# EasyEDA Pro project ProPrj_ExtModule-003_2025-06-06.epro

# Schematic ExtModule-003
Board Name: ExtModule-003; Create Date: 2025-05-14; Page Name: Core; Project Name: ExtModule-003; Schematic Name: ExtModule-003; Update Date: 2025-05-14; Company: 嘉立创EDA; Page Size: A4; Version: V1.0
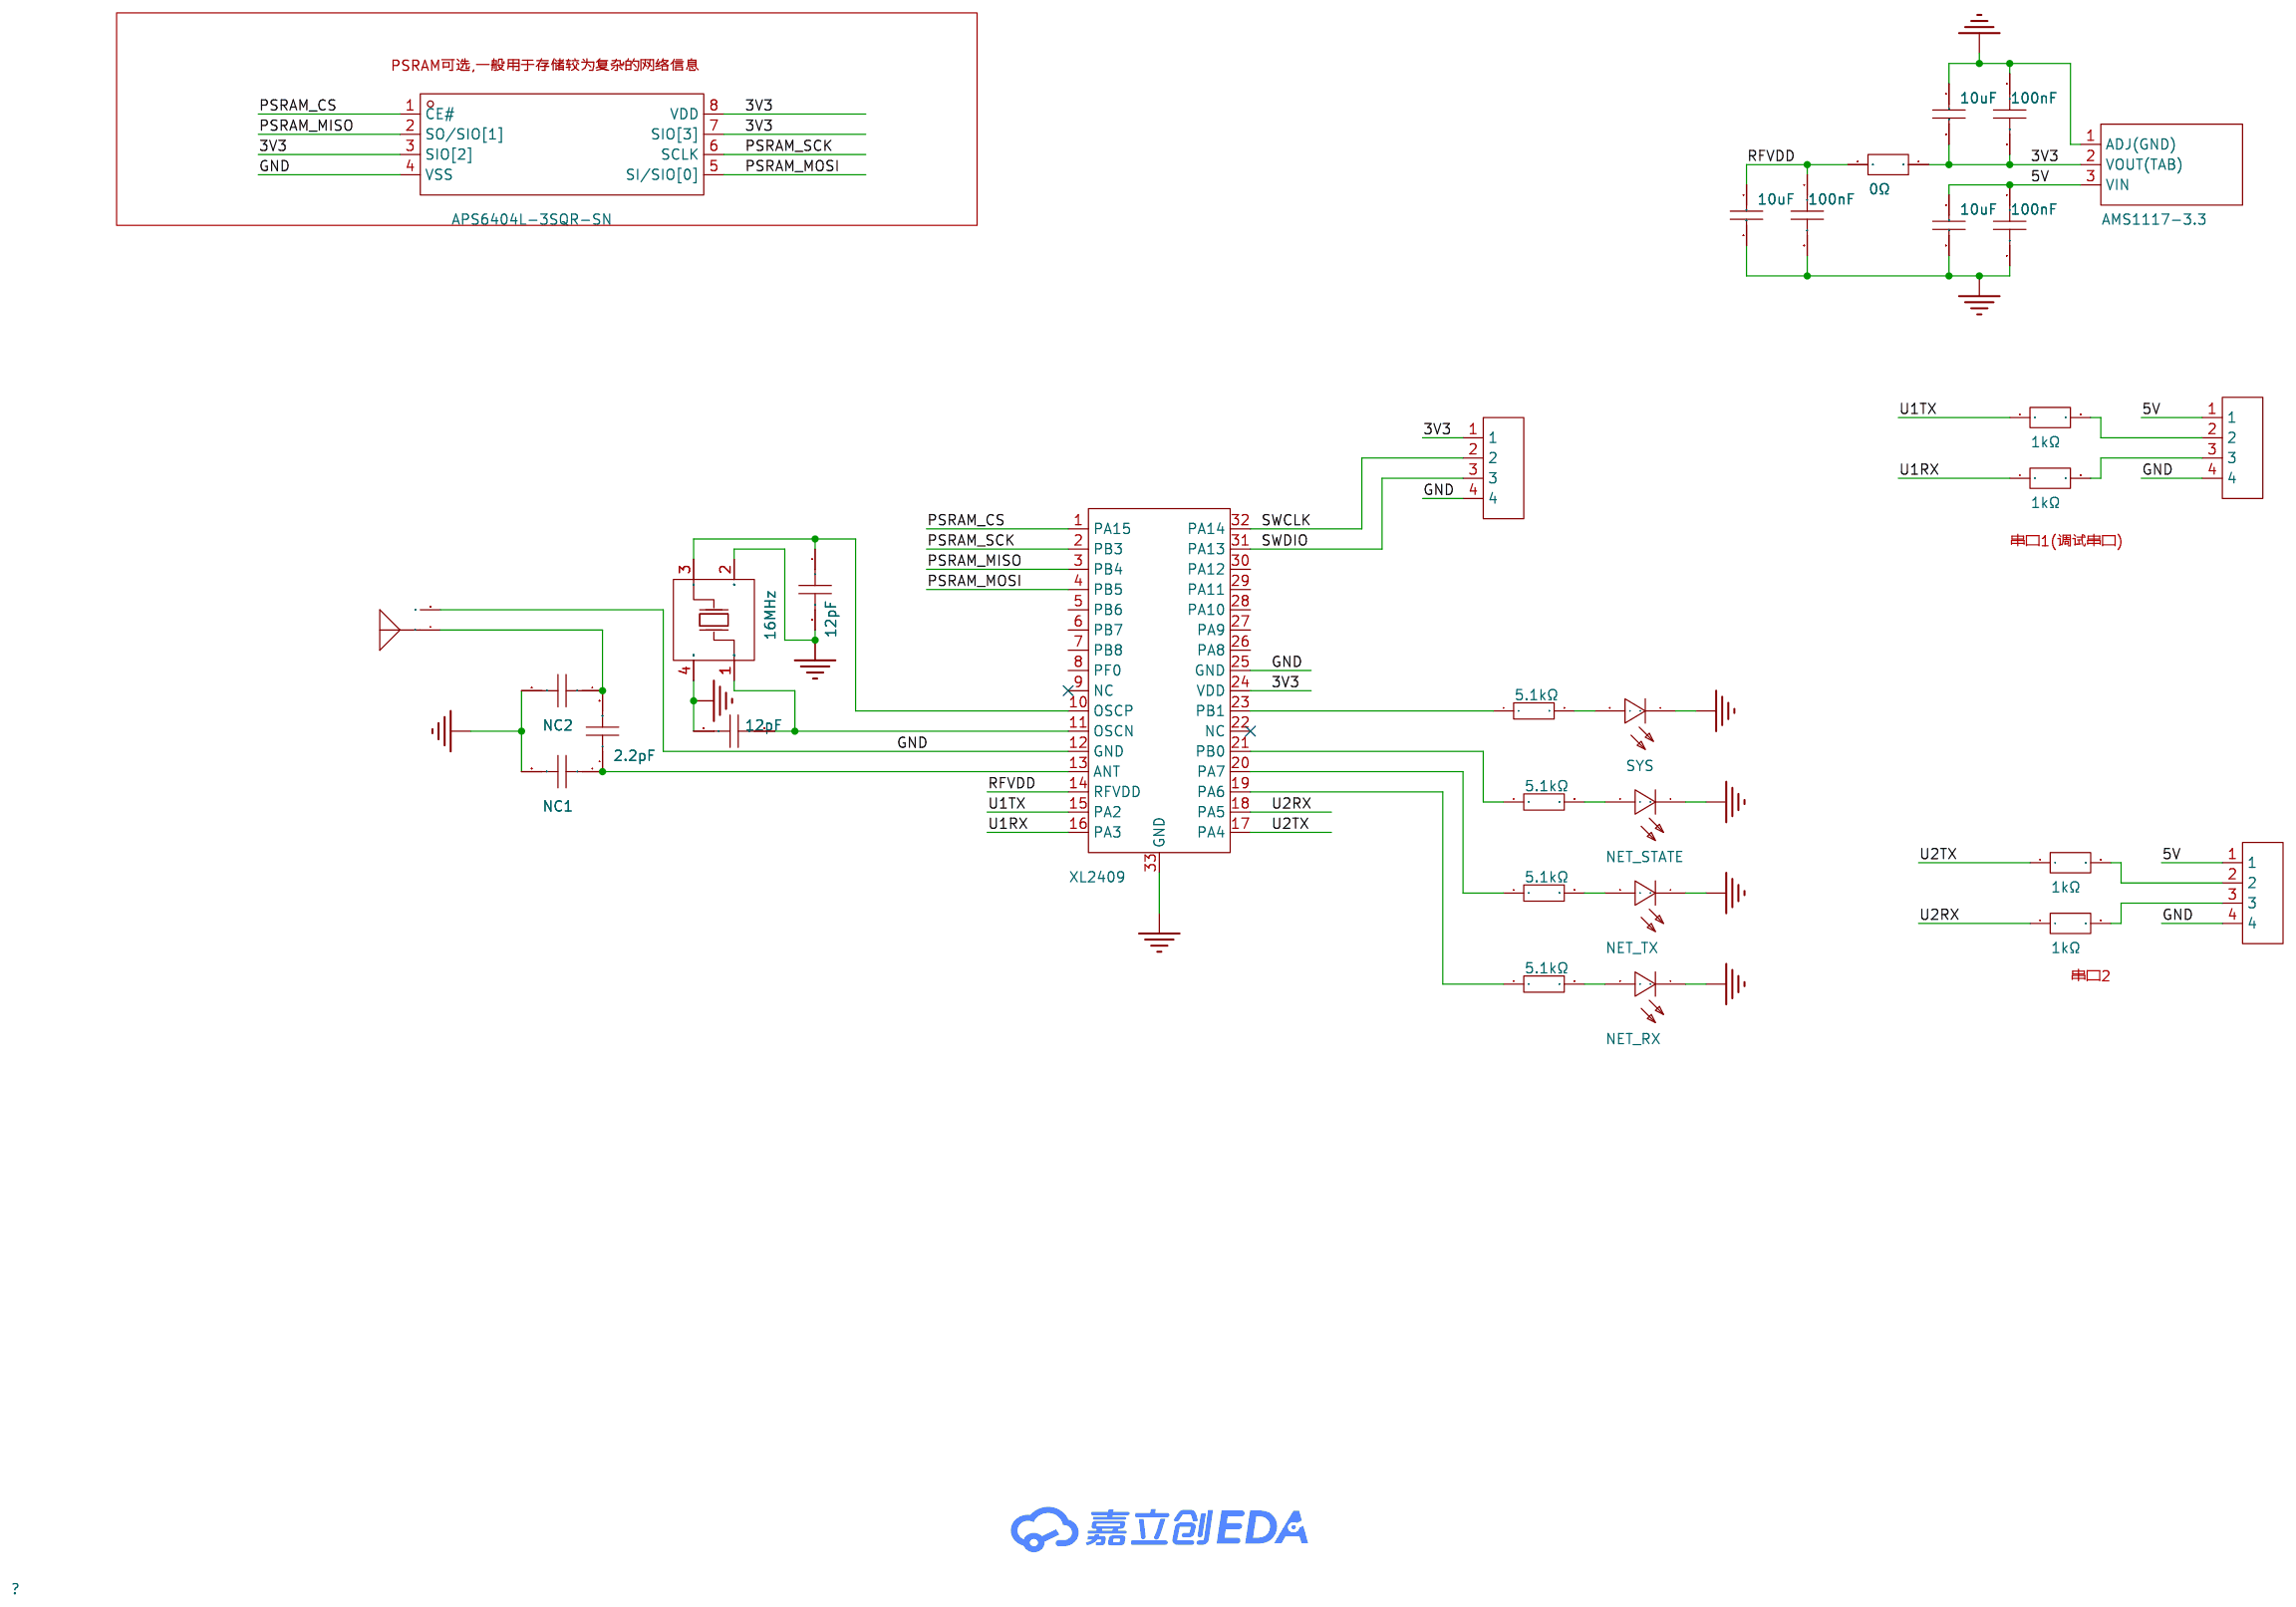
[diagram p0: schematic sheet]

## Parts
C3  100nF  [C0402]
C4  10uF  [C0402]
C5  10uF  [C0402]
C6  100nF  [C0402]
C7  10uF  [C0402]
C8  100nF  [C0402]
C9  2.2pF  [C0402]
C10  12pF  [C0402]
C11  12pF  [C0402]
H1  PZ254R-11-04P  [HDR-TH_4P-P2.54-H-M-W10.4]
H2  PZ254R-11-04P  [HDR-TH_4P-P2.54-H-M-W10.4]
H3  PZ254R-11-04P  [HDR-TH_4P-P2.54-H-M-W10.4]
L1  KH-3216-A27  [ANT-SMD_L3.2-W1.6]
LED2  SYS  [LED0603-RD_RED]
LED3  NET_STATE  [LED0603-RD_RED]
LED4  NET_TX  [LED0603-RD_RED]
LED5  NET_RX  [LED0603-RD_RED]
NC1  9pF  [C0402]  (no BOM)
NC2  9pF  [C0402]  (no BOM)
R1  0Ω  [R0402]
R18  5.1kΩ  [R0402]
R19  5.1kΩ  [R0402]
R20  5.1kΩ  [R0402]
R21  5.1kΩ  [R0402]
R22  1kΩ  [R0402]
R23  1kΩ  [R0402]
R24  1kΩ  [R0402]
R25  1kΩ  [R0402]
U1  XL2409  [QFN-32_L4.0-W4.0-P0.40-BL-EP2.7-A]
U2  AMS1117-3.3  [SOT-89_L4.5-W2.5-P1.50-LS4.2-BR]
U3  APS6404L-3SQR-SN  [SOIC-8_L4.9-W3.9-P1.27-LS6.0-BL]
X1  16MHz  [CRYSTAL-SMD_4P-L3.2-W2.5-BL]

## Library data of the parts
C3 C6 C8 = CC0402KRX7R7BB104: 容值:100nF;精度:±10%;额定电压:16V;材质(温度系数):X7R;; LCSC Part Name: 100nF ±10% 16V; Supplier Part: C60474; Manufacturer: YAGEO(国巨); Supplier Footprint: 0402; JLCPCB Part Class: Extended Part; Datasheet: https://atta.szlcsc.com/upload/public/pdf/source/20211223/9278FD768280B81DDBEF48FA36411A03.pdf; Supplier: LCSC; Tolerance: ±10%; Voltage Rated: 16V; Temperature Coefficient: X7R
C4 C5 C7 = CL05A106MQ5NUNC: 容值:10uF;精度:±20%;额定电压:6.3V;材质(温度系数):X5R;; LCSC Part Name: 10uF ±20% 6.3V; Supplier Part: C15525; Manufacturer: SAMSUNG(三星); Supplier Footprint: 0402; JLCPCB Part Class: 基础库; Datasheet: https://atta.szlcsc.com/upload/public/pdf/source/20220823/2B02EE04F8F211D38A52DCB16EB6BEBA.pdf; Supplier: LCSC; Tolerance: ±20%; Voltage Rated: 6.3V; Temperature Coefficient: X5R
C9 = CC0402BRNPO9BN2R2: 容值:2.2pF;额定电压:50V;材质(温度系数):NP0;; LCSC Part Name: 2.2pF 50V; Supplier Part: C325452; Manufacturer: YAGEO(国巨); Supplier Footprint: 0402; JLCPCB Part Class: 扩展库; Datasheet: https://atta.szlcsc.com/upload/public/pdf/source/20181031/C325452_4BAE4C53276CB88B8759B0E825662D7E.pdf; Supplier: LCSC; Voltage Rated: 50V; Temperature Coefficient: NP0
C10 C11 = CC0402FRNPO9BN120: 容值:12pF;精度:±1%;额定电压:50V;材质(温度系数):NP0;; LCSC Part Name: 12pF ±1% 50V; Supplier Part: C326662; Manufacturer: YAGEO(国巨); Supplier Footprint: 0402; JLCPCB Part Class: 扩展库; Datasheet: https://atta.szlcsc.com/upload/public/pdf/source/20181031/C326662_7F085433F615688AED0238E361F212AA.pdf; Supplier: LCSC; Tolerance: ±1%; Voltage Rated: 50V; Temperature Coefficient: NP0
H1-H3 = PZ254R-11-04P: 插针结构:1x4P;间距:2.54mm;行距:-;圆针/方针:方针;安装方式:弯插;排数:单排;总PIN位数:4P;额定电流:-;额定电压:-;配合针长度:6mm;塑高:2.5mm;触头材质:黄铜;触头镀层:-;工作温度:-40℃~+105℃;颜色:黑色;; LCSC Part Name: 1x4P 间距:2.54mm 方针 弯插; Supplier Part: C492412; Manufacturer: XFCN(兴飞); Supplier Footprint: 弯插,P=2.54mm; JLCPCB Part Class: 扩展库; Datasheet: https://atta.szlcsc.com/upload/public/pdf/source/20200309/C492412_B0EFFC1946AB079B8871416C4A09EF6C.pdf; Supplier: LCSC; Pin Structure: 1x4P; Pitch: 2.54mm; Circluar Pins/Square Pins: 方针; Mounting Type: 弯插; Number of Rows: 单排; Number of Pins: 4P; Length of Mating Pin: 6mm; Insulation Height: 2.5mm; Contact Material: 黄铜; Operating Temperature: -40℃~+105℃; Color: 黑色
L1 = KH-3216-A27: LCSC Part Name: Chip蓝牙贴片3.2x1.6; Supplier Part: C504001; Manufacturer: kinghelm(金航标); Supplier Footprint: 1206; JLCPCB Part Class: 扩展库; Datasheet: https://atta.szlcsc.com/upload/public/pdf/source/20200330/C504001_1885788A99ECD25C59FD63C2239A9775.pdf; Supplier: LCSC
LED2-LED5 = NCD0603R1_C84263: 灯头类型:-;发光颜色:红色;正向电压(VF):1.6V~2.6V;功率:65mW;正向电流:20mA;主波长:615nm~630nm;二极管配置:独立二极管;透镜颜色:无色透明透镜;色温:-;发光强度:80mcd~220mcd;发光角度:130°;载带方式:-;工作温度:-30℃~+85℃;; LCSC Part Name: NCD0603R1; Supplier Part: C84263; Manufacturer: 国星光电; Manufacturer Part: NCD0603R1; Supplier Footprint: 0603; JLCPCB Part Class: 扩展库; Datasheet: https://atta.szlcsc.com/upload/public/pdf/source/20200820/C84263_DABC6A75E58F576973B407FDBA283D60.pdf; Supplier: LCSC; Emitted Color: 红色; Forward Voltage (VF): 1.6V~2.6V; Power Dissipation: 65mW; Forward Current: 20mA; Dominant Wavelength: 615nm~630nm; Diode Configuration: 独立二极管; Lens Color: 无色透明透镜; Luminous Intensity: 80mcd~220mcd; Viewing Angle: 130°; Operating Temperature: -30℃~+85℃
NC1 NC2 = CC0402CRNPO9BN9R0: 容值:9pF;额定电压:50V;材质(温度系数):NP0;; LCSC Part Name: 9pF 50V; Supplier Part: C282242; Manufacturer: YAGEO(国巨); Supplier Footprint: 0402; JLCPCB Part Class: 扩展库; Datasheet: https://atta.szlcsc.com/upload/public/pdf/source/20181008/C309499_21CC21451B82C39E3D92150FD6B30293.pdf; Supplier: LCSC; Voltage Rated: 50V; Temperature Coefficient: NP0
R1 = FRC0402P000 TS: 电阻类型:厚膜电阻;阻值:0Ω;精度:±5%;功率:62.5mW;最大工作电压:50V;; LCSC Part Name: 0Ω ±5% 62.5mW 厚膜电阻; Supplier Part: C2906877; Manufacturer: FOJAN(富捷); Supplier Footprint: 0402; JLCPCB Part Class: 扩展库; Datasheet: https://atta.szlcsc.com/upload/public/pdf/source/20211221/925EC7D7225764EE0046F22065062C87.pdf; Supplier: LCSC; Type: 厚膜电阻; Tolerance: ±5%; Power(Watts): 62.5mW; Overload Voltage (Max): 50V; Operating Temperature Range: -55℃~+155℃
R18-R21 = 0402WGF5101TCE: 阻值:5.1kΩ;精度:±1%;功率:62.5mW;温度系数:±100ppm/℃;电阻类型:厚膜电阻;; LCSC Part Name: 5.1kΩ ±1% 62.5mW 厚膜电阻; Supplier Part: C25905; Manufacturer: UNI-ROYAL(厚声); Supplier Footprint: 0402; JLCPCB Part Class: Basic Part; Datasheet: https://atta.szlcsc.com/upload/public/pdf/source/20200306/C422600_1E6D84923E4A46A82E41ADD87F860B5C.pdf; Supplier: LCSC; Tolerance: ±1%; Power(Watts): 62.5mW; Overload Voltage (Max): 50V; Temperature Coefficient: ±100ppm/℃; Type: 厚膜电阻; Operating Temperature Range: -55℃~+155℃
R22-R25 = RT0402BRD071KL: 电阻类型:薄膜电阻;阻值:1kΩ;精度:±0.1%;功率:62.5mW;最大工作电压:50V;温度系数:±25ppm/℃;; LCSC Part Name: 薄膜电阻 1kΩ ±0.1% 62.5mW; Supplier Part: C852624; Manufacturer: YAGEO(国巨); Supplier Footprint: 0402; JLCPCB Part Class: 扩展库; Datasheet: https://atta.szlcsc.com/upload/public/pdf/source/20210609/C852624_9EB141A274604F87C6BB037C8019D50A.pdf; Supplier: LCSC; Type: 薄膜电阻; Tolerance: ±0.1%; Power(Watts): 62.5mW; Overload Voltage (Max): 50V; Temperature Coefficient: ±25ppm/℃; Operating Temperature Range: -55℃~+155℃
U1 = xl2409: Supplier Part: C9900060824; Supplier Footprint: QFN32 4x4; Supplier: LCSC
U2 = AMS1117-3.3_C347256: 输出类型:固定;工作电压:18V;输出电压:3.3V;输出电流:1A;电源纹波抑制比(PSRR):60dB@(120Hz);输出极性:正极;; LCSC Part Name: 输出:3.3V 电流:1A 耐压:18V; Supplier Part: C347256; Manufacturer: UMW(友台半导体); Supplier Footprint: SOT-89; JLCPCB Part Class: 扩展库; Datasheet: https://atta.szlcsc.com/upload/public/pdf/source/20241218/BAF0263FA2E44BCD8AF41AA4FA04EFAA.pdf; Supplier: LCSC; Output Type: 固定; Voltage - Supply: 18V; Output Voltage: 3.3V; Output Current: 1A; Power Supply Rejection Ratio (PSRR): 60dB@(120Hz); Voltage Dropout: 1.3V@(1A); Features: 过流保护; Output Configuration: 正极; Number of Outputs: 1
U3 = APS6404L-3SQR-SN_C5333729: Supplier Part: C5333729; Manufacturer: Apmemory; Supplier Footprint: SOP-8; JLCPCB Part Class: 扩展库; Datasheet: https://atta.szlcsc.com/upload/public/pdf/source/20230206/47F6F63A2B63C528FEFCE249E0943D90.pdf; Supplier: LCSC
X1 = X322516MOB4SI: 晶振类型:贴片晶振;频率:16MHz;常温频差:±10ppm;负载电容:12pF;频率稳定度:±20ppm;; LCSC Part Name: 16MHz ±10ppm 12pF; Supplier Part: C12668; Manufacturer: YXC(扬兴晶振); Supplier Footprint: SMD3225-4P; JLCPCB Part Class: 扩展库; Datasheet: https://atta.szlcsc.com/upload/public/pdf/source/20240329/19D5F850207469550BEB00D7DFEDBC7A.pdf; Supplier: LCSC; Type: 贴片晶振; Normal temperature Frequency Tolerance: ±10ppm; Load Capacitance: 12pF; Frequency Stability: ±20ppm; Operating Temperature: -40℃~+85℃

## Nets
3V3: C3.2 C4.2 H1.1 R1.1 U1.24(VDD) U2.2(VOUT(TAB)) U3.3(SIO[2]) U3.7(SIO[3]) U3.8(VDD)
5V: C5.1 C6.1 H2.1 H3.1 U2.3(VIN)
GND: C3.1 C4.1 C5.2 C6.2 C7.2 C8.2 C10.2 C11.2 H1.4 H2.4 H3.4 L1.2 LED2.1(K) LED3.1(K) LED4.1(K) LED5.1(K) NC1.2 NC2.2 U1.12(GND) U1.25(GND) U1.33(GND) U2.1(ADJ(GND)) U3.4(VSS) X1.2(GND) X1.4(GND)
PSRAM_CS: U1.1(PA15) U3.1(CE#)
PSRAM_MISO: U1.3(PB4) U3.2(SO/SIO[1])
PSRAM_MOSI: U1.4(PB5) U3.5(SI/SIO[0])
PSRAM_SCK: U1.2(PB3) U3.6(SCLK)
RFVDD: C7.1 C8.1 R1.2 U1.14(RFVDD)
SWCLK: H1.2 U1.32(PA14)
SWDIO: H1.3 U1.31(PA13)
U1RX: R23.1 U1.16(PA3)
U1TX: R22.1 U1.15(PA2)
U2RX: R25.1 U1.18(PA5)
U2TX: R24.1 U1.17(PA4)
$1N1097: C9.2 L1.1(ANT) NC2.1
$1N1099: C9.1 NC1.1 U1.13(ANT)
$1N1315: C10.1 U1.11(OSCN) X1.1(OSC1)
$1N1320: C11.1 U1.10(OSCP) X1.3(OSC2)
$1N1862: LED2.2(A) R18.2
$1N1909: R18.1 U1.23(PB1)
$1N2006: LED3.2(A) R19.2
$1N2104: LED4.2(A) R20.2
$1N2202: LED5.2(A) R21.2
$1N2207: R19.1 U1.21(PB0)
$1N2213: R20.1 U1.20(PA7)
$1N2219: R21.1 U1.19(PA6)
$1N2527: H2.3 R23.2
$1N2533: H2.2 R22.2
$1N2540: H3.2 R24.2
$1N2547: H3.3 R25.2

Not connected (* = marked no-connect by the designer): U1 5(PB6) 6(PB7) 7(PB8) 8(PF0) 9(NC)* 22(NC)* 26(PA8) 27(PA9) 28(PA10) 29(PA11) 30(PA12)

## Notes on the sheet
- PSRAM可选,一般用于存储较为复杂的网络信息
- 串口1(调试串口)
- 串口2

# Board ExtModule-003
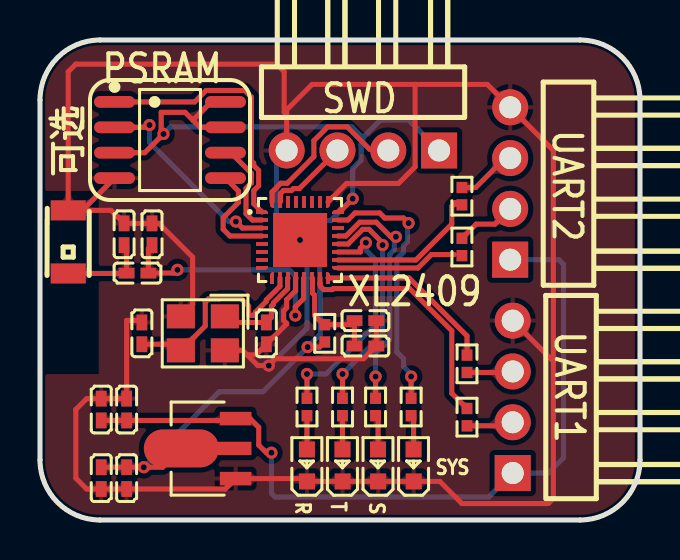
[diagram p1: board, top side]
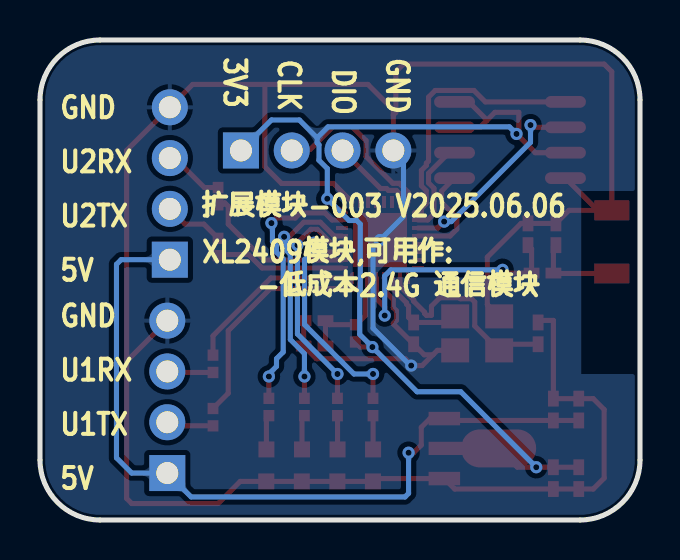
[diagram p2: board, bottom side, seen from below]

Outline 30 x 24 mm; copper layers: Top Layer, Bottom Layer. Coordinates in mm from the lower left corner of the outline.
Outline path: 0,21 0,3 arc(0.88,0.88) 3,0 27,0 arc(29.12,0.88) 30,3 30,21 arc(29.12,23.12) 27,24 3,24 arc(0.88,23.12) 0,21
Stack: Top Layer 0.035mm / Dielectric1 1.51mm FR4 er 4.5 / Bottom Layer 0.035mm

## Design rules (mm)
template: JLCPCB Capability(Two Layers Board)
spacing copperThickness1oz (default): track to track 0.102, other pairs 0.152 to 0.3
spacing copperThickness2oz: track to track 0.203, other pairs 0.152 to 0.3
track width copperThickness1oz (default): min 0.127, default 0.254, max 2.54
track width copperThickness2oz: min 0.203, default 0.254, max 2.54
differential pair differentialPair (default): width min 0.127, default 0.254, max 2.54; gap min 0.152, default 0.152
via viaSize (default): diameter min 0.5, default 0.61, max 10; hole min 0.3, default 0.305, max 6.3

## Placement (name value [footprint] x y rotation side)
C3  100nF  [C0402]  3.06 2.09 90 top
C4  10uF  [C0402]  4.33 2.09 90 top
C5  10uF  [C0402]  4.33 5.52 90 top
C6  100nF  [C0402]  3.06 5.52 90 top
C7  10uF  [C0402]  16.27 9.97 0 top
C8  100nF  [C0402]  16.27 8.7 0 top
C9  2.2pF  [C0402]  4.88 12.35 180 top
C10  12pF  [C0402]  11.32 9.33 270 top
C11  12pF  [C0402]  5.09 9.33 90 top
H1  PZ254R-11-04P  [HDR-TH_4P-P2.54-H-M-W10.4]  16.14 18.48 180 top
H2  PZ254R-11-04P  [HDR-TH_4P-P2.54-H-M-W10.4]  23.64 6.16 90 top
H3  PZ254R-11-04P  [HDR-TH_4P-P2.54-H-M-W10.4]  23.51 16.83 90 top
L1  KH-3216-A27  [ANT-SMD_L3.2-W1.6]  1.41 13.91 90 top
LED2  SYS  [LED0603-RD_RED]  18.68 2.73 90 top
LED3  NET_STATE  [LED0603-RD_RED]  16.91 2.73 90 top
LED4  NET_TX  [LED0603-RD_RED]  15.13 2.73 90 top
LED5  NET_RX  [LED0603-RD_RED]  13.35 2.73 90 top
NC1  9pF  [C0402]  5.6 14.29 90 top
NC2  9pF  [C0402]  4.21 14.29 90 top
R1  0Ω  [R0402]  14.24 9.33 90 top
R18  5.1kΩ  [R0402]  18.56 5.65 270 top
R19  5.1kΩ  [R0402]  16.78 5.65 270 top
R20  5.1kΩ  [R0402]  15.13 5.65 270 top
R21  5.1kΩ  [R0402]  13.35 5.65 270 top
R22  1kΩ  [R0402]  21.35 5.14 270 top
R23  1kΩ  [R0402]  21.35 7.81 270 top
R24  1kΩ  [R0402]  21.1 13.65 90 top
R25  1kΩ  [R0402]  21.1 16.19 90 top
U1  XL2409  [QFN-32_L4.0-W4.0-P0.40-BL-EP2.7-A]  13 14 270 top
U2  AMS1117-3.3  [SOT-89_L4.5-W2.5-P1.50-LS4.2-BR]  8.43 3.57 0 top
U3  APS6404L-3SQR-SN  [SOIC-8_L4.9-W3.9-P1.27-LS6.0-BL]  6.5 19 270 top
X1  16MHz  [CRYSTAL-SMD_4P-L3.2-W2.5-BL]  8.14 9.33 180 top

## Footprints (pads in the part's own frame, mm; a bottom-side part is the same pattern mirrored in y, then rotated)
ANT-SMD_L3.2-W1.6
  rect 1x1.75 smd: 1(-1.578,0) 2(1.578,0)
C0402
  rect 0.79x0.54 smd: 1(-0.545,0) 2(0.545,0)
CRYSTAL-SMD_4P-L3.2-W2.5-BL
  rect 1.4x1.2 smd: 1(-1.1,-0.85) 2(1.1,-0.85) 3(1.1,0.85) 4(-1.1,0.85)
HDR-TH_4P-P2.54-H-M-W10.4
  rect 1.8x1.8 hole 1.1: 1(-3.81,0)
  round 1.8 hole 1.1: 2(-1.27,0) 3(1.27,0) 4(3.81,0)
LED0603-RD_RED
  rect 0.8x0.8 smd: 1(-0.799,-0.004) 2(0.799,0.004)
QFN-32_L4.0-W4.0-P0.40-BL-EP2.7-A
  custom 0.2x0.601 smd: 1(-1.401,-1.9) 8(1.401,-1.9) 17(1.4,1.9) 24(-1.401,1.9)
  rect 0.2x0.6 smd: 2(-1,-1.9) 3(-0.6,-1.9) 4(-0.2,-1.9) 5(0.2,-1.9) 6(0.6,-1.9) 7(1,-1.9) 18(1,1.9) 19(0.6,1.9) 20(0.2,1.9) 21(-0.2,1.9) 22(-0.6,1.9) 23(-1,1.9)
  custom 0.601x0.2 smd: 9(1.9,-1.401) 16(1.9,1.4) 25(-1.9,1.401) 32(-1.9,-1.401)
  rect 0.6x0.2 smd: 10(1.9,-1) 11(1.9,-0.6) 12(1.9,-0.2) 13(1.9,0.2) 14(1.9,0.6) 15(1.9,1) 26(-1.9,1) 27(-1.9,0.6) 28(-1.9,0.2) 29(-1.9,-0.2) 30(-1.9,-0.6) 31(-1.9,-1)
  rect 2.7x2.7 smd: 33(0,0)
R0402
  rect 0.566x0.54 smd: 1(-0.433,0) 2(0.433,0)
SOIC-8_L4.9-W3.9-P1.27-LS6.0-BL
  oval 0.588x2.045 smd: 1(-1.905,-2.772) 2(-0.635,-2.772) 3(0.635,-2.772) 4(1.905,-2.772) 5(1.905,2.772) 6(0.635,2.772) 7(-0.635,2.772) 8(-1.905,2.772)
SOT-89_L4.5-W2.5-P1.50-LS4.2-BR
  rect 1.575x0.672 smd: 1(1.356,-1.5) 3(1.356,1.5)
  custom 5.377x1.9 smd: 2(-1.356,0.009)

## Nets
As in the schematic.

Pads without a net: U1 5 6 7 8 9 22 26 27 28 29 30

## Via types
v1: diameter 0.61, hole 0.305, Top Layer to Bottom Layer, 19 vias

## Routing (per net, layer and track width the routed paths; a pad name or vN(x,y) marks a point on that pad's centre or on a via; arc(x,y) is an arc through that point)
3V3: length 53.5
  Top Layer w0.254: v1(13.38,8.65) 13.99,8.65 R1.1 ; U3.7 8,19.64 7.65,19.99 ; U3.8 8.56,20.91 7.65,19.99 ; U3.3 5.24,18.36 v1(6.17,19.3) 6.06,19.42 6.06,20.38 7.26,20.38 7.65,19.99 ; 7.07,3.58 6.13,2.64 v1(5.19,2.64) C4.2 C3.2 ; v1(15.63,16.06) 15.13,15.56 15.06,15.56 U1.24
  Bottom Layer w0.254: v1(5.19,2.64) 8.96,6.41 11.15,6.41 v1(13.38,8.65) 14.01,9.28 14.01,11.37 13.98,11.4 13.98,14.79 14.16,14.97 14.54,14.97 v1(15.63,16.06) 15.63,17.57 16.05,17.99 16.05,18.77 16.14,18.86 16.14,19.11 ; v1(6.17,19.3) 6.53,19.66 15.6,19.66 16.14,19.11 ; 16.14,19.11 17.03,20 18.43,20 H1.1
5V: length 39.7
  Top Layer w0.254: C6.1 C5.1 9.69,4.98 U2.3 10.5,5.07 10.94,4.63 10.94,3.75 11.32,3.36 v1(11.57,3.36)
  Bottom Layer w0.254: H3.1 25.94,13.02 26.18,12.78 26.18,3.11 25.41,2.35 H2.1 22.44,1.15 11.75,1.15 11.57,1.33 v1(11.57,3.36)
GND: length 142.1
  Top Layer w0.254: 25.67,7.94 25.67,1.08 25.41,0.82 21.1,0.82 19.99,1.93 LED2.1 LED3.1 LED4.1 LED5.1 13.21,2.07 U2.1 9.26,1.55 C4.1 C3.1 2.34,1.55 1.79,2.09 1.79,5.52 2.34,6.07 C6.2 C5.2 4.33,9.98 4.99,9.98 C11.2 ; 25.67,7.94 25.67,18.48 H3.4 22.37,21.78 18.76,21.78 ; 25.67,7.94 H2.4 ; X1.2 7.63,10.78 7.63,13.14 5.95,14.83 NC1.2 NC2.2 3.55,15.48 2.12,15.48 U3.4 ; 10.35,8.26 10.89,7.72 v1(11.44,7.72) 11.44,7.77 11.74,8.06 16.18,8.06 C8.2 C7.2 ; 10.35,8.26 10.79,8.26 C10.2 12.33,9.8 12.33,9.83 12.18,9.98 12.18,10.46 12.33,10.62 12.33,11.02 12.78,11.46 12.78,12.08 U1.12 ; 10.35,8.26 10.13,8.48 X1.4 ; U1.25 15.33,16.83 17.92,16.83 18.76,17.66 18.76,21.78 ; 18.76,21.78 13.6,21.78 12.33,20.51 12.33,20.25 ; 12.33,20.25 H1.4 ; 12.33,20.25 12.21,20.38 12.21,22.41 11.82,22.8 1.79,22.8 1.41,22.41 L1.2
  Bottom Layer w0.254: v1(11.44,7.72) 11.48,7.72 13.35,9.59 13.35,13.65 v1(13,14) 11.82,15.17 11.82,17.97 H1.4
PSRAM_CS: length 13.4
  Top Layer w0.254: U3.1 7.73,20.91 8.31,21.48 10.24,21.48 10.57,21.14 10.57,17.95 10.68,17.84 10.68,17.73 10.93,17.48 10.93,16.71 10.69,16.47 10.69,15.81 U1.1
PSRAM_MISO: length 10.1
  Top Layer w0.254: U1.3 10.11,14.6 v1(9.79,14.92) ; U3.2 5.36,19.64 v1(5.47,19.75)
  Bottom Layer w0.254: v1(9.79,14.92) 9.43,14.92 5.47,18.88 v1(5.47,19.75)
PSRAM_MOSI: length 5.2
  Top Layer w0.254: U3.5 9.92,16.45 9.92,15.87 9.16,15.11 9.16,14.54 9.5,14.2 U1.4
PSRAM_SCK: length 4.8
  Top Layer w0.254: U3.6 9.54,18.36 10.57,17.33 10.57,16.86 10.3,16.58 10.3,15.31 10.62,15 U1.2
RFVDD: length 5.5
  Top Layer w0.254: U1.14 13.62,12.08 13.62,11.35 13.73,11.24 13.73,10.22 14.19,9.77 R1.2 15.52,9.77 15.72,9.97 15.72,8.7
SWCLK: length 8.6
  Top Layer w0.254: U1.32 11.6,16.4 12.04,16.83 12.36,16.83 13.69,18.17 13.69,18.97 14.38,19.66 15.36,19.66 16.49,18.53 17.36,18.53 H1.2
SWDIO: length 4.2
  Top Layer w0.254: U1.31 12.02,15.92 12.02,16.32 12.18,16.48 12.58,16.48 12.67,16.57 12.97,16.57 H1.3
U1RX: length 9.1
  Top Layer w0.254: U1.16 18.46,12.1 21.35,9.21 R23.1
U1TX: length 12.2
  Top Layer w0.254: R22.1 20.59,6.34 20.59,9.46 18.48,11.57 14.67,11.57 14.62,11.52 14.18,11.52 14.02,11.68 14.02,11.79 14,11.81 U1.15
U2RX: length 8
  Top Layer w0.254: 21.11,15.77 20.86,15.77 20.77,15.86 20.59,15.68 20.59,14.79 18.79,13 U1.18
U2TX: length 6.1
  Top Layer w0.254: U1.17 18.9,12.6 19.57,13.27 20.72,13.27
$1N1097: length 4.4
  Top Layer w0.254: L1.1 4.31,12.33 C9.2 4.33,13.62 NC2.1
$1N1099: length 13
  Top Layer w0.254: U1.13 13.18,12.08 13.18,11.07 12.76,10.65 v1(12.76,10.22) ; v1(6.87,12.51) 6.71,12.35 C9.1 5.42,13.56 NC1.1
  Bottom Layer w0.254: v1(12.76,10.22) 12.76,12.2 12.46,12.51 v1(6.87,12.51)
$1N1315: length 4.7
  Top Layer w0.254: U1.11 12.38,12.08 12.38,11.56 11.67,10.86 11.67,10.79 11.57,10.69 11.57,10.13 C10.1 9.69,9.88 9.39,10.18
$1N1320: length 10.5
  Top Layer w0.254: C11.1 6.74,8.79 X1.3 8.26,9.7 8.26,10.9 8.43,11.06 8.98,11.06 9.03,11.11 10.01,11.11 10.43,10.69 10.43,10.23 10.68,10.23 10.77,10.32 10.77,10.39 11.32,10.94 11.32,11.01 12,11.69 U1.10
$1N1862: length 1.7
  Top Layer w0.254: LED2.2 18.68,5.09 R18.2
$1N1909: length 13.2
  Top Layer w0.254: U1.23 15.4,15 15.75,15.35 16.98,15.35 17.24,15.1 18.18,15.1 v1(18.43,14.84) ; R18.1 v1(18.56,7.17)
  Bottom Layer w0.254: v1(18.56,7.17) 18.56,7.3 18.18,7.68 18.18,8.06 17.84,8.4 17.84,13.05 18.18,13.39 18.18,13.71 18.38,13.92 18.38,14.79 v1(18.43,14.84)
$1N2006: length 1.7
  Top Layer w0.254: LED3.2 16.9,5.09 R19.2
$1N2104: length 1.7
  Top Layer w0.254: R20.2 15.12,5.21 LED4.2
$1N2202: length 1.7
  Top Layer w0.254: R21.2 13.35,5.21 LED5.2
$1N2207: length 12
  Top Layer w0.254: U1.21 15.29,14.2 15.98,14.89 16.81,14.89 17.54,14.16 v1(17.79,14.16) ; R19.1 v1(16.78,7.17)
  Bottom Layer w0.254: v1(16.78,7.17) 16.78,8.32 17.48,9.02 17.48,13.28 17.71,13.51 17.71,14.08 v1(17.79,14.16)
$1N2213: length 11.4
  Top Layer w0.254: U1.20 15.4,13.8 16.14,14.53 16.45,14.53 17.13,13.86 v1(17.13,13.75) ; R20.1 v1(15.13,7.3)
  Bottom Layer w0.254: v1(15.13,7.3) 17.13,9.3 v1(17.13,13.75)
$1N2219: length 11.7
  Top Layer w0.254: U1.19 16.02,13.4 16.02,13.59 v1(16.29,13.87) ; R21.1 v1(13.35,7.3)
  Bottom Layer w0.254: v1(16.29,13.87) 16.29,13.5 16.77,13.02 16.77,9.77 14.3,7.3 v1(13.35,7.3)
$1N2527: length 2.3
  Top Layer w0.254: H2.3 23.58,7.38 R23.2
$1N2533: length 2.4
  Top Layer w0.254: H2.2 23.46,4.71 R22.2
$1N2540: length 3
  Top Layer w0.254: H3.2 22.75,14.79 21.81,14.79 R24.2
$1N2547: length 3
  Top Layer w0.254: H3.3 23.25,18.1 21.78,16.62 R25.2

## Copper pours and planes (outline as drawn; the poured copper is in the pictures)
GND on Top Layer: -0.88,31.81 30.75,31.81 30.75,-4.64 -0.88,-4.64
GND on Bottom Layer: -3.29,27.62 33.67,27.62 33.67,-5.27 -3.29,-5.27

Small or netless copper shapes (teardrops, artwork), in the pictures only: 110 on Top Layer, 24 on Bottom Layer

## Text on the board
Bottom Silkscreen Layer: GND | U2RX | U2TX | 5V | U1RX | U1TX | DIO | CLK | 3V3 | XL2409模块,可用作: / -低成本2.4G 通信模块 | 扩展模块-003 V2025.06.06
Top Silkscreen Layer: SYS | R | T | S | PSRAM | SWD | UART2 | UART1 | XL2409 | 可选
